# EAGLE design max30100 (EAGLE 9.5.1)
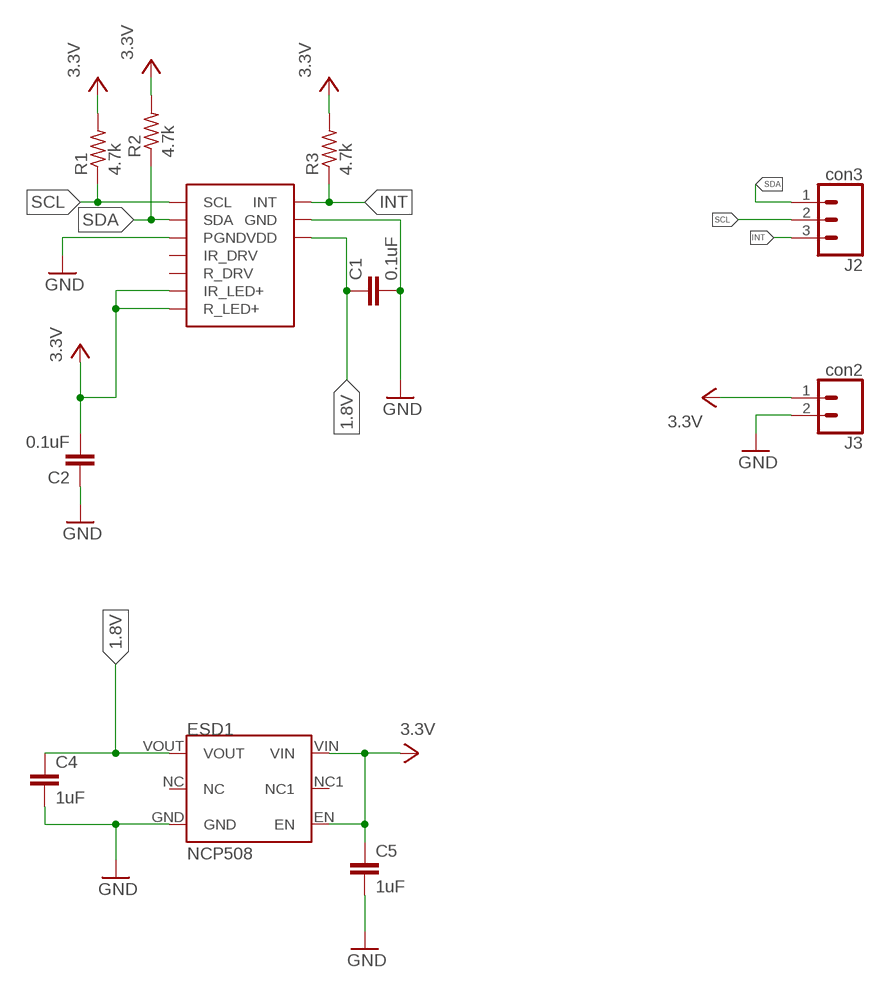
[diagram p0: schematic, sheet 1]

## Parts
C1  0.1uF  C-EUC0603  [C0603]
C2  0.1uF  C-EUC0603  [C0603]
C4  1uF  C-EUC0603K  [C0603K]
C5  1uF  C-EUC0603K  [C0603K]
ESD1  NCP508  [UQFN6]
J2  con3  CONN_03  [1X03]
J3  con2  CONN_02  [1X02]
R1  4.7k  R-US_R0603  [R0603]
R2  4.7k  R-US_R0603  [R0603]
R3  4.7k  R-US_R0603  [R0603]
U$1  MAX30100  [MAX30100]

## Nets
1.8V: C1.1 C4.1 ESD1.VOUT U$1.11(VDD)
GND: C1.2 C2.1 C4.2 C5.2 ESD1.GND J3.2 U$1.4(PGND) U$1.12(GND)
INT: J2.3 R3.1 U$1.13(INT)
SCL: J2.2 R1.1 U$1.2(SCL)
SDA: J2.1 R2.1 U$1.3(SDA)
VCC: C2.2 C5.1 ESD1.EN ESD1.VIN J3.1 R1.2 R2.2 R3.2 U$1.9(R_LED+) U$1.10(IR_LED+) ; supply symbol labelled 3.3V
Unconnected: ESD1.NC ESD1.NC1 U$1.5(IR_DRV) U$1.6(R_DRV)

## Library data of the parts
C1 C2 = rcl:C-EU: CAPACITOR, European symbol; SPICEPREFIX: C
C4 C5 = bmd200_sdcard_vm05:C-EU: CAPACITOR, European symbol
ESD1 = bmd200_sdcard_vm05:NCP508: Large bandwidth ESD protection Usable for ESD protection of USB, Ethernet, Video, etc Datasheet <http://www.st.com/web/en/resource/technical/document/datasheet/CD00178569.pdf>; AVAILABILITY: Unavailable; DESCRIPTION: USBULC6 Series 6 V 2 Channel SMT Bi-Directional ESD Protection - UQFN-6; MF: STMicroelectronics; MP: USBULC6-2M6; PACKAGE: UFDFN-6 STMicroelectronics; PRICE: None
J2 = SparkFun-Connectors:CONN_03: Multi connection point. Often used as Generic Header-pin footprint for 0.1 inch spaced/style header connections On any of the 0.1 inch spaced packages, you can populate with these: Break Away Headers - Straight <https://www.sparkfun.com/products/116> (PRT-00116) Break Away Male Headers - Right Angle <https://www.sparkfun.com/products/553> (PRT-00553) Female Headers <https://www.sparkfun.com/products/115> (PRT-00115) Break Away Headers - Machine Pin <https://www.sparkfun.com/products/117> (PRT-00117) Break Away Female Headers - Swiss Machine Pin <https://www.sparkfun.com/products/743> (PRT-00743) Stackable Header - 3 Pin (Female, 0.1") <https://www.sparkfun.com/products/13875> (PRT-13875) For SCREWTERMINALS and SPRING TERMINALS visit here: Screw Terimnals on SparkFun.com <https://www.sparkfun.com/search/results?term=Screw+Terminals> (5mm/3.5mm/2.54mm spacing) This device is also useful as a general connection point to wire up your design to another part of your project. Our various solder wires solder well into these plated through hole pads. Hook-Up Wire - Assortment (Stranded, 22 AWG) <https://www.sparkfun.com/products/11375> (PRT-11375) Hook-Up Wire - Assortment (Solid Core, 22 AWG) <https://www.sparkfun.com/products/11367> (PRT-11367) View the entire wire category on our website here <https://www.sparkfun.com/categories/141> Special notes: Molex polarized connector foot print use with SKU : PRT-08232 with associated crimp pins and housings.
J3 = SparkFun-Connectors:CONN_02: Multi connection point. Often used as Generic Header-pin footprint for 0.1 inch spaced/style header connections On any of the 0.1 inch spaced packages, you can populate with these: Break Away Headers - Straight <https://www.sparkfun.com/products/116> (PRT-00116) Break Away Male Headers - Right Angle <https://www.sparkfun.com/products/553> (PRT-00553) Female Headers <https://www.sparkfun.com/products/115> (PRT-00115) Break Away Headers - Machine Pin <https://www.sparkfun.com/products/117> (PRT-00117) Break Away Female Headers - Swiss Machine Pin <https://www.sparkfun.com/products/743> (PRT-00743) For SCREWTERMINALS and SPRING TERMINALS visit here: Screw Terimnals on SparkFun.com <https://www.sparkfun.com/search/results?term=Screw+Terminals> (5mm/3.5mm/2.54mm spacing) This device is also useful as a general connection point to wire up your design to another part of your project. Our various solder wires solder well into these plated through hole pads. Hook-Up Wire - Assortment (Stranded, 22 AWG) <https://www.sparkfun.com/products/11375> (PRT-11375) Hook-Up Wire - Assortment (Solid Core, 22 AWG) <https://www.sparkfun.com/products/11367> (PRT-11367) View the entire wire category on our website here <https://www.sparkfun.com/categories/141> Special notes: Molex polarized connector foot print use with: PRT-08233 with associated crimp pins and housings. 2.54_SCREWTERM for use with PRT-10571. 3.5mm Screw Terminal footprints for PRT-08084 5mm Screw Terminal footprints for use with PRT-08432
R1-R3 = rcl:R-US_: RESISTOR, American symbol; SPICEPREFIX: R
U$1 = MAX30100:MAX30100

## Board
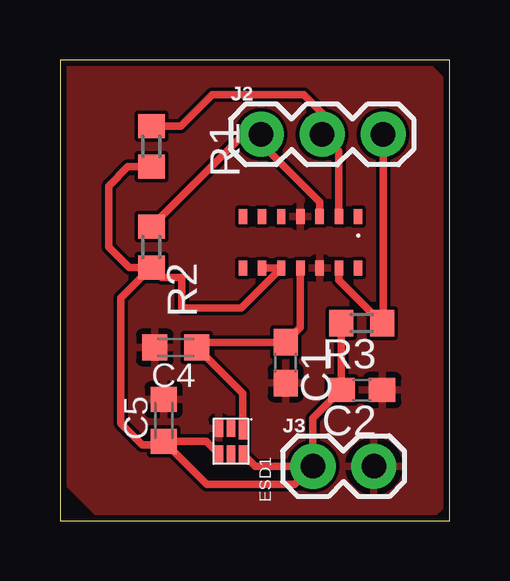
[diagram p1: board, top side]

Size 16.24 x 19.23 mm. Coordinates in mm from the lower left corner, seen from the top.
Outline: 0,0 16.24,0 16.24,19.23 0,19.23 0,0
Copper layers (1*16): Top 0.035mm / dielectric 1.5mm / Bottom 0.035mm
Design rules "seeed-studio-2-layer": minimum track width 6mil, minimum drill 12mil, track to track 6mil, track to pad 6mil, pad to pad 6mil, via to via 6mil, smd to smd 0mil, copper to edge 10mil, drill to drill 10mil, minimum pad ring 10mil, minimum via ring 6mil, stop-mask expansion 2mil, vias tented up to drill 100mil, thermal gap 10mil

### Footprints (pad centres in the part's own frame; a part is rotated, then mirrored left to right if it is on the bottom)
C0603 = smd 1.1 x 1: 1 -0.85,0; 2 0.85,0
C0603K = smd 1.05 x 1.08: 1 -0.875,0; 2 0.875,0
UQFN6 = smd 0.35 x 0.73: EN 1,0; GND 1,-1.07; NC 0.5,-1.07; NC1 0.5,0; VIN 0,0 | smd 0.35 x 0.83: VOUT 0,-1.02
1X03 = drill 1.016 pad 1.88: 1 0,0; 2 2.54,0; 3 5.08,0
1X02 = drill 1.016 pad 1.88: 1 0,0; 2 2.54,0
R0603 = smd 1 x 1.1: 1 -0.85,0; 2 0.85,0
MAX30100 = smd 0.635 x 0.35: 1 0,4.8; 2 0,4; 3 0,3.2; 4 0,2.4; 5 0,1.6; 6 0,0.8; 7 0,0; 8 2.15,0; 9 2.15,0.8; 10 2.15,1.6; 11 2.15,2.4; 12 2.15,3.2; 13 2.15,4; 14 2.15,4.8

### Placement (x,y rotation side)
C1  9.4,6.6 270 top
C2  12.57,5.46 180 top
C4  4.83,7.24 180 top
C5  4.32,4.19 90 top
ESD1  7.62,2.79 180 top
J2  8.38,16.13 0 top
J3  10.54,2.29 0 top
R1  3.81,15.62 270 top
R2  3.81,11.43 270 top
R3  12.57,8.25 180 top
U$1  7.62,12.7 270 top

### Tracks (layer width: path | path; a pad name or v marks a point on that pad's centre or on a via)
1.8V
  Top 0.305: U$1.11 10.02,8.08 C1.1 5.92,7.45 C4.1 7.62,5.32 ESD1.VOUT
GND
  pour Top: 0,19.05 15.24,19.05 16.13,18.16 16.13,0.89 15.24,0 1.9,0 0.25,1.65 0,1.91
INT
  Top 0.305: U$1.13 11.62,10.06 13.21,8.47 R3.1 13.46,8.22 J2.3
SCL
  Top 0.305: J2.2 10.99,16.07 | 10.99,16.07 11.62,15.43 U$1.2 | R1.1 5.04,16.47 6.35,17.78 10.16,17.78 10.99,16.95 10.99,16.07
SDA
  Top 0.305: R2.1 7.66,16.13 J2.1 8.38,15.75 10.82,13.31 U$1.3
VCC
  Top 0.305: U$1.9 U$1.10 7.56,8.89 5.08,8.89 5.08,10.16 4.23,10.16 R2.2 | J3.1 10.54,4.28 C2.2 R3.2 | R2.2 2.54,9.31 2.54,4.06 3.43,3.17 4.18,3.17 C5.1 | R1.2 2.83,14.77 2.03,13.97 2.03,11.43 2.88,10.58 R2.2 | C5.1 6.1,3.32 ESD1.EN | ESD1.VIN 8.13,2.29 J3.1 | C5.1 6.11,1.52 9.78,1.52 J3.1